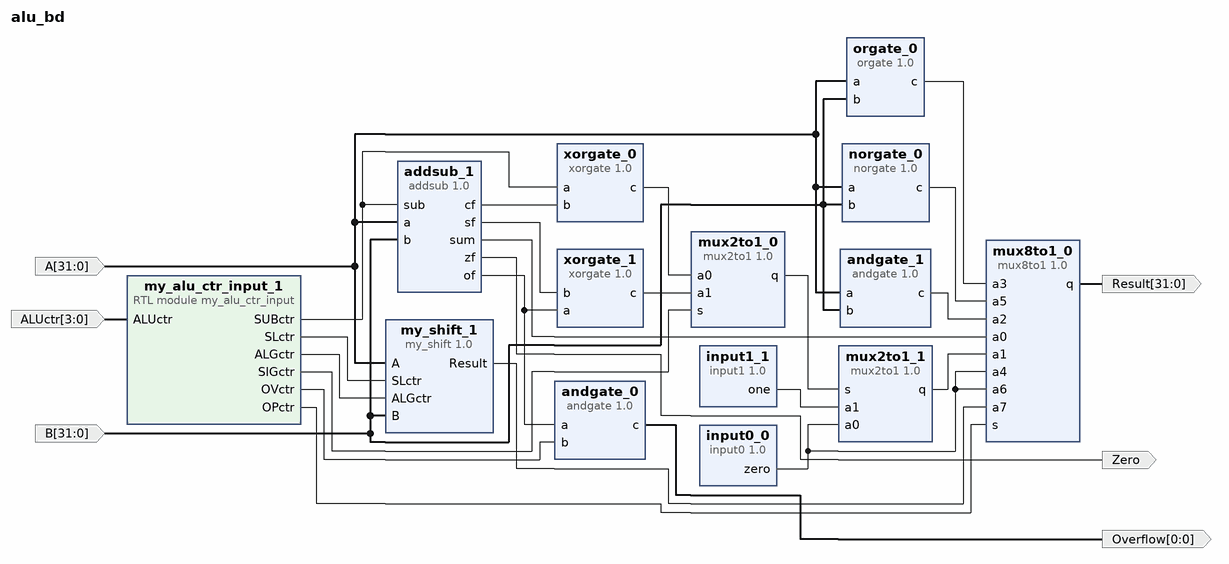
[diagram p0: block diagram of the top level]
# Vivado block design alu_bd, Vivado 2016.2
create_bd_design alu_bd

create_bd_port -dir I -from 31 -to 0 A
create_bd_port -dir I -from 31 -to 0 B
create_bd_port -dir O -from 0 -to 0 Overflow
create_bd_port -dir I -from 3 -to 0 ALUctr
create_bd_port -dir O -from 31 -to 0 Result
create_bd_port -dir O Zero

create_bd_cell -type ip -vlnv CSE:CSE:andgate:1.0 andgate_0
set_property -dict {CONFIG.WIDTH 1} [get_bd_cells andgate_0]
create_bd_cell -type ip -vlnv CSE:CSE:andgate:1.0 andgate_1
set_property -dict {CONFIG.WIDTH 32} [get_bd_cells andgate_1]
create_bd_cell -type ip -vlnv CSE:CSE:mux2to1:1.0 mux2to1_0
set_property -dict {CONFIG.WIDTH 1} [get_bd_cells mux2to1_0]
create_bd_cell -type ip -vlnv CSE:CSE:mux2to1:1.0 mux2to1_1
set_property -dict {CONFIG.WIDTH 32} [get_bd_cells mux2to1_1]
create_bd_cell -type ip -vlnv CSE:CSE:norgate:1.0 norgate_0
set_property -dict {CONFIG.WIDTH 32} [get_bd_cells norgate_0]
create_bd_cell -type ip -vlnv CSE:CSE:orgate:1.0 orgate_0
set_property -dict {CONFIG.WIDTH 32} [get_bd_cells orgate_0]
create_bd_cell -type ip -vlnv CSE:CSE:xorgate:1.0 xorgate_0
set_property -dict {CONFIG.WIDTH 1} [get_bd_cells xorgate_0]
create_bd_cell -type ip -vlnv CSE:CSE:xorgate:1.0 xorgate_1
set_property -dict {CONFIG.WIDTH 1} [get_bd_cells xorgate_1]
create_bd_cell -type ip -vlnv CSE:CSE:my_shift:1.0 my_shift_1
create_bd_cell -type ip -vlnv CSE:CSE:mux8to1:1.0 mux8to1_0
set_property -dict {CONFIG.WIDTH 32} [get_bd_cells mux8to1_0]
create_bd_cell -type ip -vlnv CSE:CSE:addsub:1.0 addsub_1
set_property -dict {CONFIG.WIDTH 32} [get_bd_cells addsub_1]
create_bd_cell -type ip -vlnv CSE:CSE:input0:1.0 input0_0
create_bd_cell -type ip -vlnv CSE:CSE:input1:1.0 input1_1
create_bd_cell -type module -reference my_alu_ctr_input my_alu_ctr_input_1

# ---- connections ----

connect_bd_net [get_bd_ports A] \
  [get_bd_pins orgate_0/a] [get_bd_pins andgate_1/a] [get_bd_pins norgate_0/a] [get_bd_pins my_shift_1/A] \
  [get_bd_pins addsub_1/a]
connect_bd_net [get_bd_ports B] \
  [get_bd_pins orgate_0/b] [get_bd_pins andgate_1/b] [get_bd_pins norgate_0/b] [get_bd_pins my_shift_1/B] \
  [get_bd_pins addsub_1/b]
connect_bd_net [get_bd_pins andgate_0/c] [get_bd_ports Overflow]
connect_bd_net [get_bd_pins andgate_1/c] [get_bd_pins mux8to1_0/a2]
connect_bd_net [get_bd_pins mux2to1_0/q] [get_bd_pins mux2to1_1/s]
connect_bd_net [get_bd_pins mux2to1_1/q] [get_bd_pins mux8to1_0/a1]
connect_bd_net [get_bd_pins norgate_0/c] [get_bd_pins mux8to1_0/a5]
connect_bd_net [get_bd_pins orgate_0/c] [get_bd_pins mux8to1_0/a3]
connect_bd_net [get_bd_pins xorgate_0/c] [get_bd_pins mux2to1_0/a0]
connect_bd_net [get_bd_pins xorgate_1/c] [get_bd_pins mux2to1_0/a1]
connect_bd_net [get_bd_pins my_shift_1/Result] [get_bd_pins mux8to1_0/a7]
connect_bd_net [get_bd_ports ALUctr] [get_bd_pins my_alu_ctr_input_1/ALUctr]
connect_bd_net [get_bd_pins mux8to1_0/q] [get_bd_ports Result]
connect_bd_net [get_bd_pins addsub_1/sum] [get_bd_pins mux8to1_0/a0]
connect_bd_net [get_bd_pins addsub_1/cf] [get_bd_pins xorgate_0/b]
connect_bd_net [get_bd_pins addsub_1/of] [get_bd_pins xorgate_1/a] [get_bd_pins andgate_0/a]
connect_bd_net [get_bd_pins addsub_1/sf] [get_bd_pins xorgate_1/b]
connect_bd_net [get_bd_pins addsub_1/zf] [get_bd_ports Zero]
connect_bd_net [get_bd_pins input1_1/one] [get_bd_pins mux2to1_1/a1]
connect_bd_net [get_bd_pins input0_0/zero] [get_bd_pins mux8to1_0/a4] [get_bd_pins mux8to1_0/a6] [get_bd_pins mux2to1_1/a0]
connect_bd_net [get_bd_pins my_alu_ctr_input_1/SUBctr] [get_bd_pins xorgate_0/a] [get_bd_pins addsub_1/sub]
connect_bd_net [get_bd_pins my_alu_ctr_input_1/OVctr] [get_bd_pins andgate_0/b]
connect_bd_net [get_bd_pins my_alu_ctr_input_1/SIGctr] [get_bd_pins mux2to1_0/s]
connect_bd_net [get_bd_pins my_alu_ctr_input_1/OPctr] [get_bd_pins mux8to1_0/s]
connect_bd_net [get_bd_pins my_alu_ctr_input_1/SLctr] [get_bd_pins my_shift_1/SLctr]
connect_bd_net [get_bd_pins my_alu_ctr_input_1/ALGctr] [get_bd_pins my_shift_1/ALGctr]

validate_bd_design
save_bd_design
